# EAGLE design ovc3868-1 (EAGLE 6.5.0)
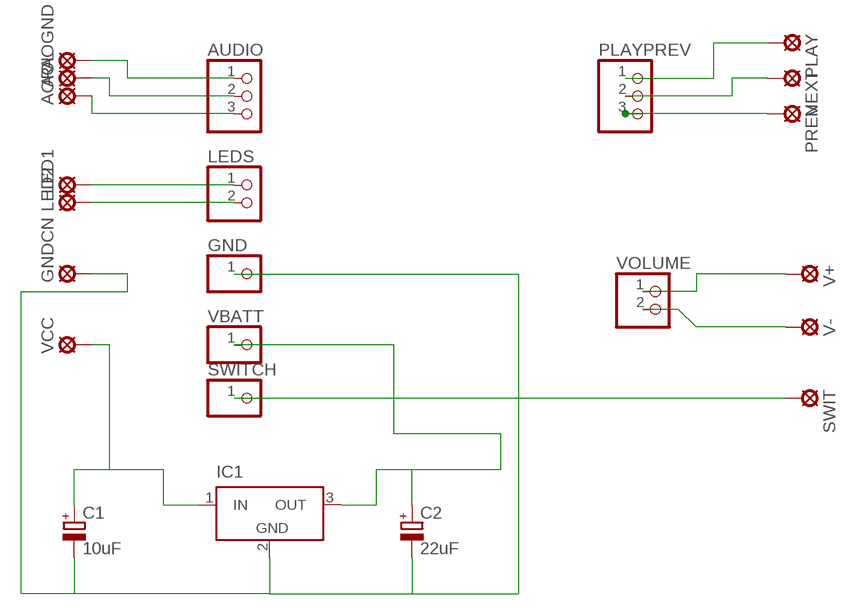
[diagram p0: schematic, sheet 1]

## Parts
AOGND  MCS08  [MCS08]
AOL  MCS08  [MCS08]
AOR  MCS08  [MCS08]
AUDIO  PINHD-1X3  [1X03]
C1  10uF  CPOL-EU140CLH-0810  [140CLH-0810]
C2  22uF  CPOL-EU140CLH-0810  [140CLH-0810]
GND  PINHD-1X1  [1X01]
GNDCN  MCS08  [MCS08]
IC1  LT1129CST5  [SOT223]
LED1  MCS08  [MCS08]
LED2  MCS08  [MCS08]
LEDS  PINHD-1X2  [1X02]
NEXT  MCS08  [MCS08]
PLAY  MCS08  [MCS08]
PLAYPREV  PINHD-1X3  [1X03]
PREV  MCS08  [MCS08]
SWIT  MCS08  [MCS08]
SWITCH  PINHD-1X1  [1X01]
V+  MCS08  [MCS08]
V-  MCS08  [MCS08]
VBATT  PINHD-1X1  [1X01]
VCC  MCS08  [MCS08]
VOLUME  PINHD-1X2  [1X02]

## Nets
N$1: C1.+ IC1.1(IN) VCC.MP
N$2: C1.- C2.- GND.1 GNDCN.MP IC1.2(GND)
N$3: C2.+ IC1.3(OUT) VBATT.1
N$4: SWIT.MP SWITCH.1
N$5: LED2.MP LEDS.2
N$6: LED1.MP LEDS.1
N$7: AOR.MP AUDIO.3
N$8: AOL.MP AUDIO.2
N$9: AOGND.MP AUDIO.1
N$10: PLAY.MP PLAYPREV.1
N$11: NEXT.MP PLAYPREV.2
N$12: PLAYPREV.3 PREV.MP
N$13: V+.MP VOLUME.1
N$14: V-.MP VOLUME.2

## Power pins joined to a net without a drawn wire
GND: IC1.4(GND)

## Library data of the parts
AOGND AOL AOR GNDCN LED1 LED2 NEXT PLAY PREV SWIT V+ V- VCC = solpad:MCS08: SOLDER PAD MC S0,8, drill 1.2 mm, distributor Buerklin, 08F130
AUDIO PLAYPREV = pinhead:PINHD-1X3: PIN HEADER
C1 C2 = rcl:CPOL-EU: POLARIZED CAPACITOR, European symbol
GND SWITCH VBATT = pinhead:PINHD-1X1: PIN HEADER
IC1 = linear-technology:LT1129CST5: VOLTAGE REGULATOR with shutdown; MPN: LT1129CST-5#PBF; OC_FARNELL: 1663375; OC_NEWARK: 57M2069
LEDS VOLUME = pinhead:PINHD-1X2: PIN HEADER

## Board
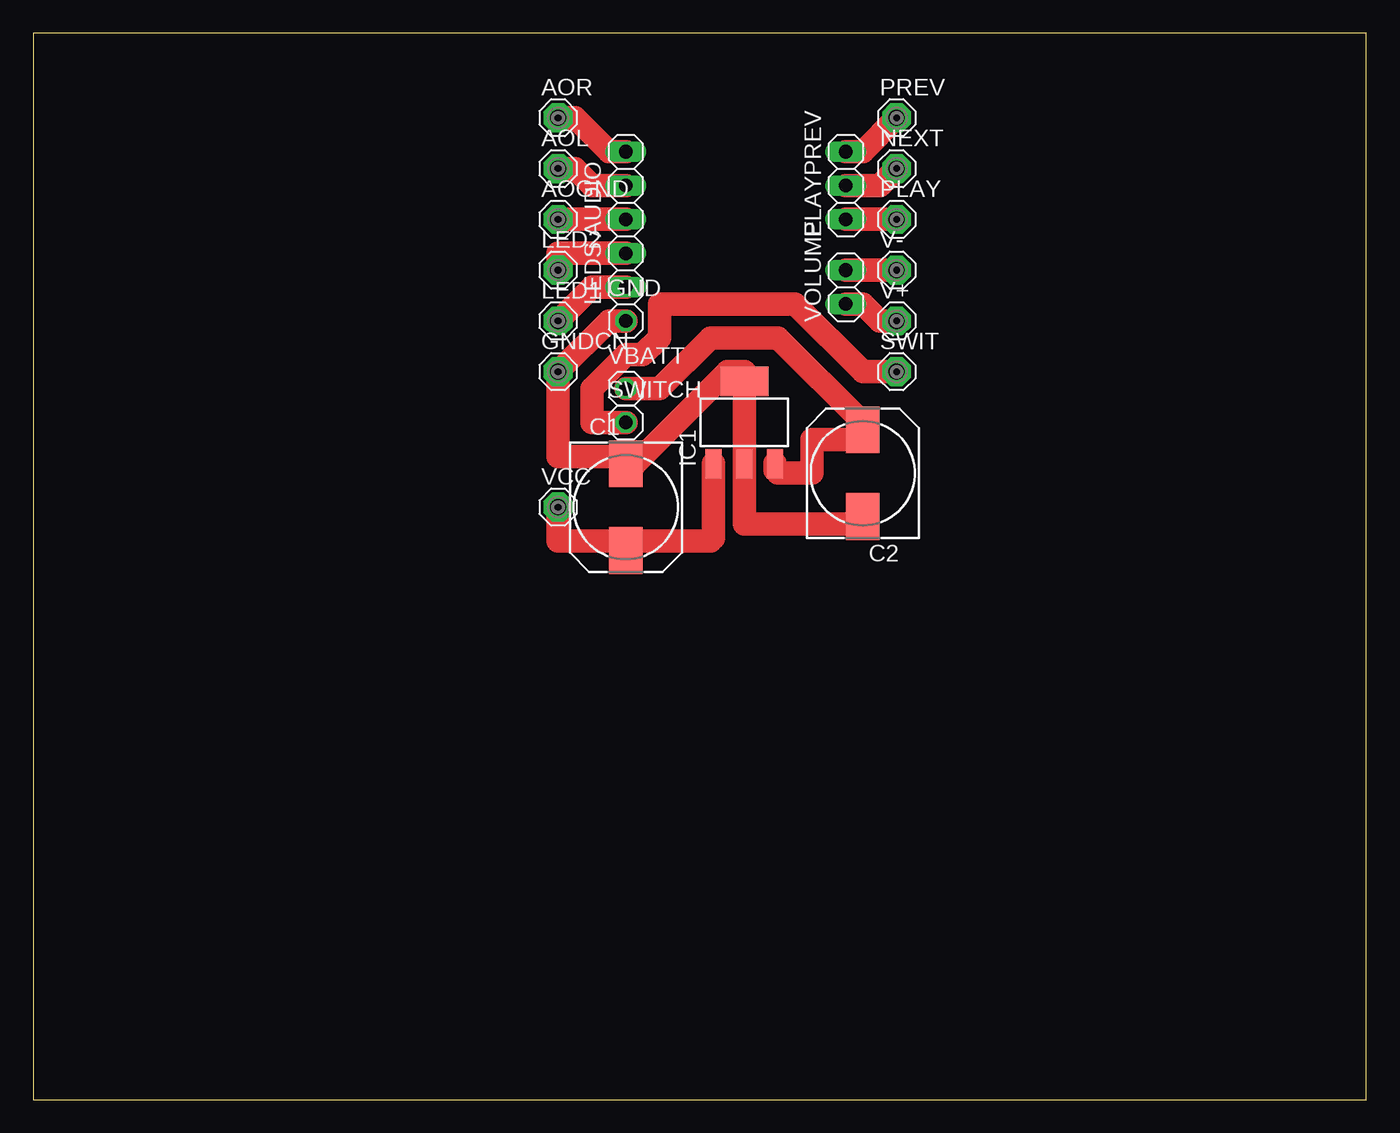
[diagram p1: board, top side]

Size 100 x 80 mm. Coordinates in mm from the lower left corner, seen from the top.
Outline: 0,0 100,0 100,80 0,80 0,0
Copper layers (1*16): Top 0.035mm / dielectric 1.5mm / Bottom 0.035mm
Design rules "default": minimum track width 10mil, minimum drill 24mil, track to track 8mil, track to pad 8mil, pad to pad 8mil, via to via 8mil, smd to smd 8mil, copper to edge 40mil, drill to drill 8mil, minimum pad ring 10mil, minimum via ring 8mil, stop-mask expansion 4mil, vias tented up to drill 0mil, thermal gap 10mil

### Footprints (pad centres in the part's own frame; a part is rotated, then mirrored left to right if it is on the bottom)
MCS08 = drill 1.194 pad 2.159 octagon: MP 0,0
1X03 = drill 1.016 long: 1 -2.54,0; 2 0,0; 3 2.54,0
140CLH-0810 = smd 3.5 x 2.5: + 3.25,0; - -3.25,0
1X01 = drill 1.016 octagon: 1 0,0
SOT223 = smd 1.219 x 2.235: 1 -2.311,-3.099; 2 0,-3.099; 3 2.311,-3.099 | smd 3.6 x 2.2: 4 0,3.099
1X02 = drill 1.016 long: 1 -1.27,0; 2 1.27,0

### Placement (x,y rotation side)
AOGND  39.37,66.04 0 top
AOL  39.37,69.85 0 top
AOR  39.37,73.66 0 top
AUDIO  44.45,68.58 90 top
C1  44.45,44.45 270 top
C2  62.23,46.99 90 top
GND  44.45,58.42 0 top
GNDCN  39.37,54.61 0 top
IC1  53.34,50.8 0 top
LED1  39.37,58.42 0 top
LED2  39.37,62.23 0 top
LEDS  44.45,62.23 90 top
NEXT  64.77,69.85 0 top
PLAY  64.77,66.04 0 top
PLAYPREV  60.96,68.58 90 top
PREV  64.77,73.66 0 top
SWIT  64.77,54.61 0 top
SWITCH  44.45,50.8 0 top
V+  64.77,58.42 0 top
V-  64.77,62.23 0 top
VBATT  44.45,53.34 0 top
VCC  39.37,44.45 0 top
VOLUME  60.96,60.96 90 top

### Tracks (layer width: path | path; a pad name or v marks a point on that pad's centre or on a via)
N$1
  Top 1.778: VCC.MP 39.37,41.91 44.45,41.91 C1.+ 45.16,41.91 50.8,41.91 51.03,42.14 IC1.1
N$2
  Top 1.778: GND.1 43.18,58.42 GNDCN.MP 39.37,48.26 43.89,48.26 C1.- 45.16,47.7 52.07,54.61 53.34,54.61 IC1.2 53.34,43.18 62.23,43.18 C2.-
N$3
  Top 1.778: IC1.3 55.65,47.22 55.88,46.99 58.42,46.99 58.42,49.53 61.52,49.53 C2.+ 62.23,50.8 55.88,57.15 50.8,57.15 46.99,53.34 VBATT.1
N$4
  Top 1.778: SWITCH.1 41.91,50.8 41.91,53.34 44.45,55.88 45.72,55.88 46.99,57.15 46.99,59.69 57.15,59.69 62.23,54.61 SWIT.MP
N$5
  Top 1.778: LEDS.2 39.37,63.5 LED2.MP
N$6
  Top 1.778: LEDS.1 41.91,60.96 LED1.MP
N$7
  Top 1.778: AUDIO.3 43.18,71.12 40.64,73.66 AOR.MP
N$8
  Top 1.778: AUDIO.2 41.91,68.58 40.64,69.85 AOL.MP
N$9
  Top 1.778: AUDIO.1 AOGND.MP
N$10
  Top 1.778: PLAYPREV.1 PLAY.MP
N$11
  Top 1.778: PLAYPREV.2 63.5,68.58 NEXT.MP
N$12
  Top 1.778: PLAYPREV.3 62.23,71.12 PREV.MP
N$13
  Top 1.778: VOLUME.1 62.23,59.69 63.5,58.42 V+.MP
N$14
  Top 1.778: VOLUME.2 V-.MP